# Altium schematic sheet 02-USER_IO.SchDoc
size A3; DocumentNumber: 1; SheetNumber: 2; SheetTotal: 12
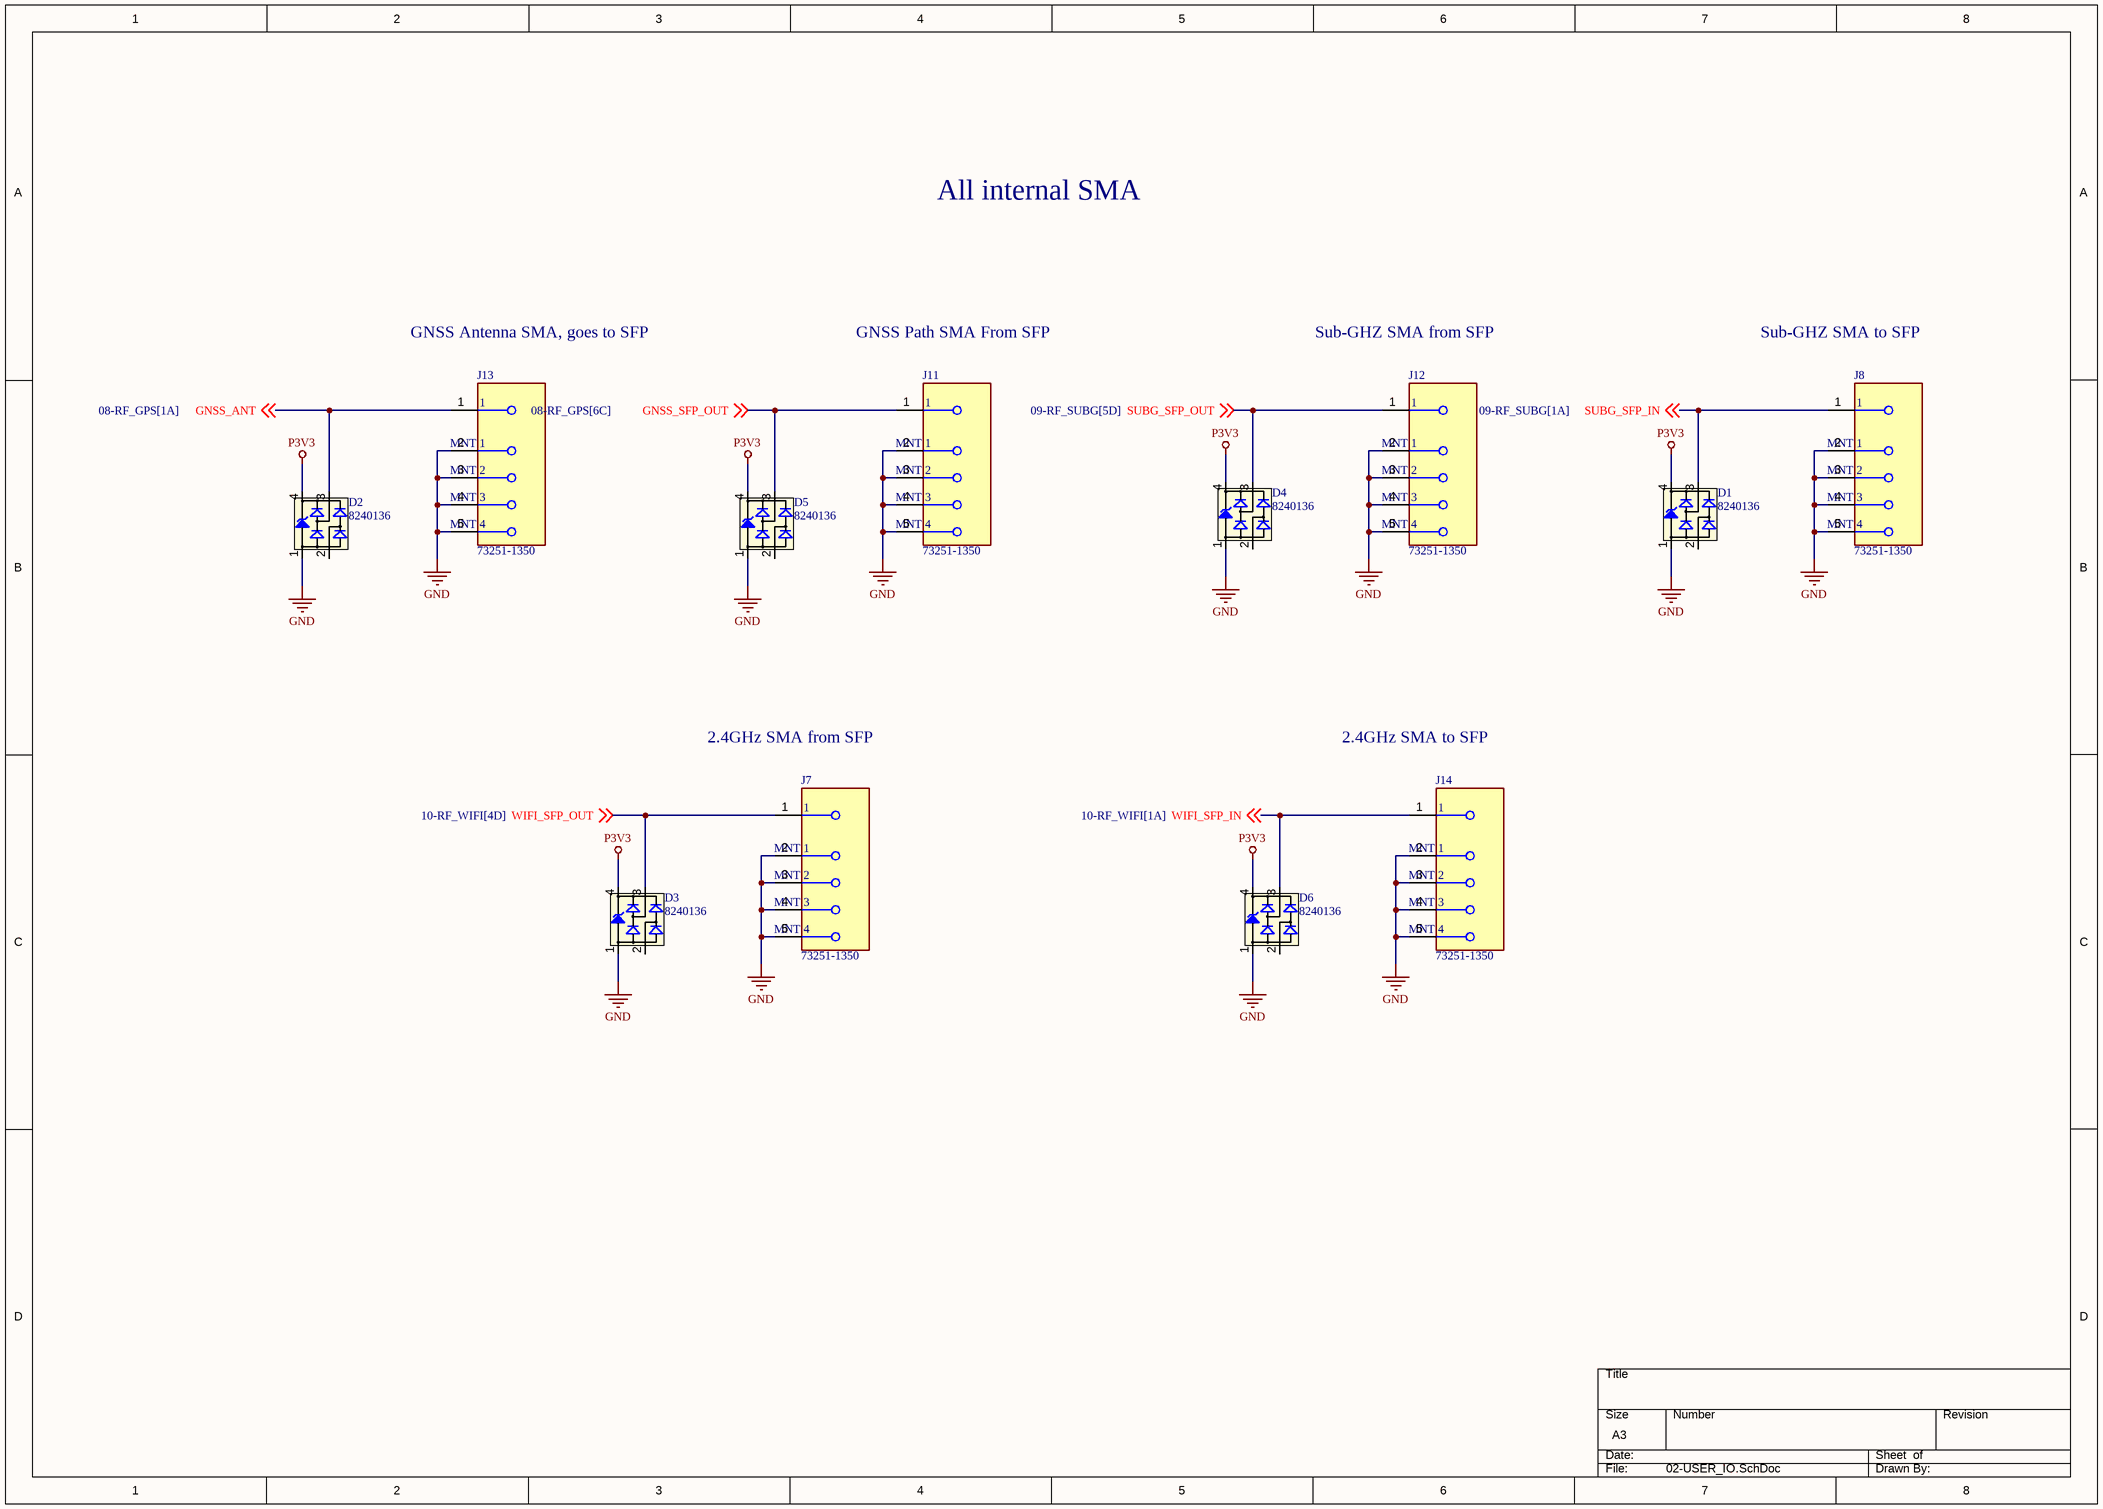
[diagram p0: 02-USER_IO.SchDoc]

## Parts
D1  8240136  [SOT143-4L]
D2  8240136  [SOT143-4L]
D3  8240136  [SOT143-4L]
D4  8240136  [SOT143-4L]
D5  8240136  [SOT143-4L]
D6  8240136  [SOT143-4L]
J7  73251-1350  [FP-73251-1350-MFG]
J8  73251-1350  [FP-73251-1350-MFG]
J11  73251-1350  [FP-73251-1350-MFG]
J12  73251-1350  [FP-73251-1350-MFG]
J13  73251-1350  [FP-73251-1350-MFG]
J14  73251-1350  [FP-73251-1350-MFG]

## Nets
GND: D1.1(GND) D2.1(GND) D3.1(GND) D4.1(GND) D5.1(GND) D6.1(GND) J7.2(MNT_1) J7.3(MNT_2) J7.4(MNT_3) J7.5(MNT_4) J8.2(MNT_1) J8.3(MNT_2) J8.4(MNT_3) J8.5(MNT_4) J11.2(MNT_1) J11.3(MNT_2) J11.4(MNT_3) J11.5(MNT_4) J12.2(MNT_1) J12.3(MNT_2) J12.4(MNT_3) J12.5(MNT_4) J13.2(MNT_1) J13.3(MNT_2) J13.4(MNT_3) J13.5(MNT_4) J14.2(MNT_1) J14.3(MNT_2) J14.4(MNT_3) J14.5(MNT_4)
P3V3: D1.4(VDD) D2.4(VDD) D3.4(VDD) D4.4(VDD) D5.4(VDD) D6.4(VDD)
GNSS_ANT: D2.3(I/O2) J13.1 ; off-sheet GNSS_ANT
GNSS_SFP_OUT: D5.3(I/O2) J11.1 ; off-sheet GNSS_SFP_OUT
SUBG_SFP_IN: D1.3(I/O2) J8.1 ; off-sheet SUBG_SFP_IN
SUBG_SFP_OUT: D4.3(I/O2) J12.1 ; off-sheet SUBG_SFP_OUT
WIFI_SFP_IN: D6.3(I/O2) J14.1 ; off-sheet WIFI_SFP_IN
WIFI_SFP_OUT: D3.3(I/O2) J7.1 ; off-sheet WIFI_SFP_OUT

Not connected (* = marked no-connect by the designer): D1 2(I/O1); D2 2(I/O1); D3 2(I/O1); D4 2(I/O1); D5 2(I/O1); D6 2(I/O1)

## Notes on the sheet
- All internal SMA
- GNSS Antenna SMA, goes to SFP
- GNSS Path SMA From SFP
- Sub-GHZ SMA from SFP
- Sub-GHZ SMA to SFP
- 2.4GHz SMA from SFP
- 2.4GHz SMA to SFP
- SHEET
- REV
- timingcard.com <http://timingcard.com>
- DATE
- OF

## Library data of the parts
D1-D6 = CMP-1486-00002-1: TVS Diode WE-TVS-HS, VRWM=3.3V; Manufacturer: Wuerth Elektronik; Reverse Stand Off Voltage: 3.3V; PartNumber: 8240136; ComponentLink1Description: Manufacturer URL; PackageReference: SOT143-4L; ComponentLink1URL: http://www.we-online.com; ComponentLink2Description: Datasheet; ComponentLink2URL: http://katalog.we-online.de/kataloge/eisos/media/pdf/8240136.pdf
J7 J8 J11-J14 = CMP-04764-000006-1: CONN SMA JACK STR 50 OHM SMD; Manufacturer: Molex; Is Female: yes; Standoff Height: 0.41mm; Impedance: 50Ω; Number Of Contacts: 1; Conn Orientation: Straight; Voltage Rating: 500V; Shielding: true; Frequency: 18GHz; Package: 73251-1350; Device Class L1: Connectors; Category: Conn; Manufacturer Part Number: 73251-1350; ComponentLink2URL: https://www.molex.com/pdm_docs/sd/732511350_sd.pdf; Automotive: No; Height: 9.655mm; Octopart: https://octopart.com/73251-1350-molex-5414390; Footprint Url: https://forum.upverter.com/uploads/default/original/3X/d/a/daeafa2ce4908d4fc4e49f0b17d7d2c986fce444.pdf; Temperature Range High: +165°C; Device Class L3: unset; Mouser Description: RF Connectors / Coaxial Connectors SMA ST PCB-JCK STD SMT; Lead Free: Yes; Temperature: -65°C to +165°C; RoHS: TRUE; ComponentLink2Description: Datasheet; Device Class L2: RF / Coaxial Connectors; Digikey Description: CONN SMA JACK STR 50 OHM SMD; Contact Material: Gold; Temperature Range Low: -65°C